# Altium project SolMPPT.PrjPcb
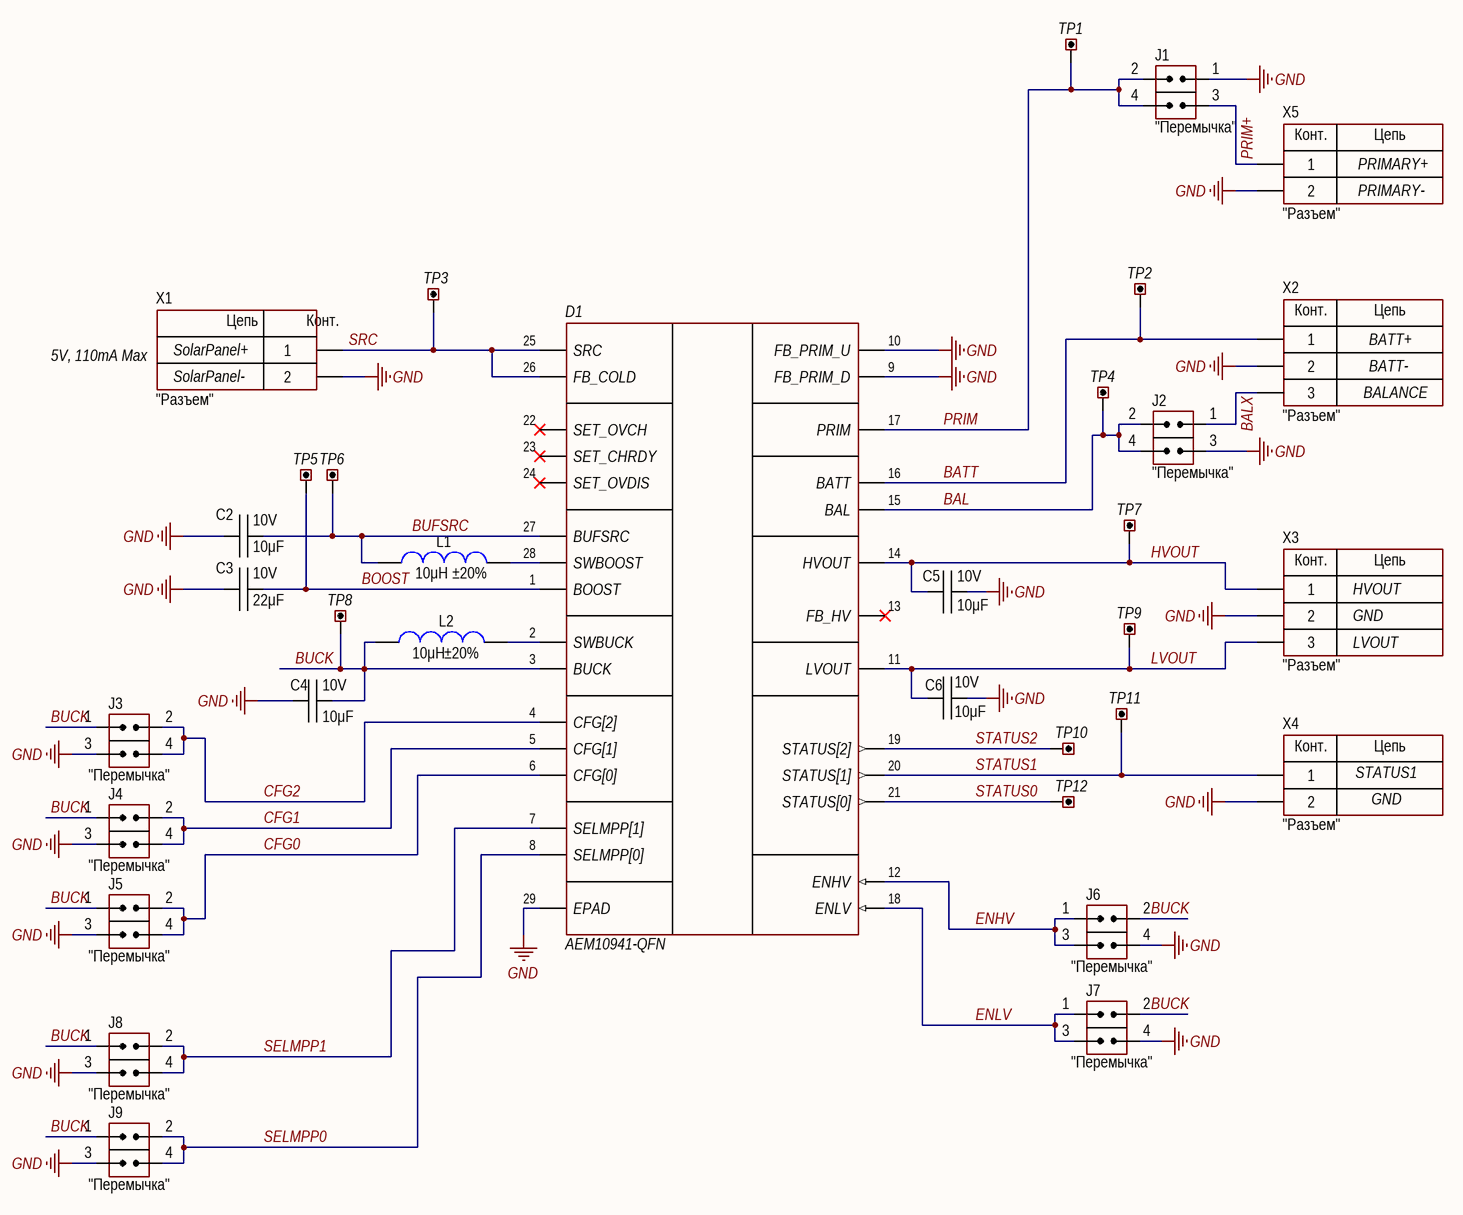
[diagram p0: page1.SchDoc]
1 sheet, 34 parts. Net scope: global (net labels, ports and power ports of the same name join across sheets).
Board file: PCB.PcbDoc

## Sheet page1.SchDoc
size 420 x 297 mm; Author: Шпаков Д.; Address1: Address1; Address2: Address2; Address3: Address3; Address4: Address4; DocumentNumber: SolMPPT.0.0.2; SheetNumber: 1; Scale: 1:1; DocumentType: Схема электрическая принципиальная; FirstReferrence: SolMPPT.0.0.2

### Parts
C2  value 10μF  Voltage: 10V  [CAP: 0603]
C3  value 22μF  Voltage: 10V  [CAP: 0603]
C4  value 10μF  Voltage: 10V  [CAP: 0603]
C5  value 10μF  Voltage: 10V  [CAP: 0603]
C6  value 10μF  Voltage: 10V  [CAP: 0603]
D1  AEM10941-QFN  [QFN50P500X500X85_HS-29N]
J1  CommentText: "Перемычка"  [CON: JUMPER x2]
J2  CommentText: "Перемычка"  [CON: JUMPER x2]
J3  CommentText: "Перемычка"  [CON: JUMPER x2]
J4  CommentText: "Перемычка"  [CON: JUMPER x2]
J5  CommentText: "Перемычка"  [CON: JUMPER x2]
J6  CommentText: "Перемычка"  [CON: JUMPER x2]
J7  CommentText: "Перемычка"  [CON: JUMPER x2]
J8  CommentText: "Перемычка"  [CON: JUMPER x2]
J9  CommentText: "Перемычка"  [CON: JUMPER x2]
L1  value 10μH  Tolerance: ±20%  [IND: SDR0302]
L2  value 10μH  Tolerance: ±20%  [IND: 0603]
TP1  TestPoint  [TestPad]  (value not drawn)
TP2  TestPoint  [TestPad]  (value not drawn)
TP3  TestPoint  [TestPad]  (value not drawn)
TP4  TestPoint  [TestPad]  (value not drawn)
TP5  TestPoint  [TestPad]  (value not drawn)
TP6  TestPoint  [TestPad]  (value not drawn)
TP7  TestPoint  [TestPad]  (value not drawn)
TP8  TestPoint  [TestPad]  (value not drawn)
TP9  TestPoint  [TestPad]  (value not drawn)
TP10  TestPoint  [TestPad]  (value not drawn)
TP11  TestPoint  [TestPad]  (value not drawn)
TP12  TestPoint  [TestPad]  (value not drawn)
X1  CommentText: "Разъем"  [CON: PLS-2]
X2  CommentText: "Разъем"  [CON: PLS-3]
X3  CommentText: "Разъем"  [CON: PLS-3]
X4  CommentText: "Разъем"  [CON: PLS-2]
X5  CommentText: "Разъем"  [CON: PLS-2]

### Nets
GND: C2.1 C3.2 C4.1 C5.1 C6.2 D1.9(FB_PRIM_D) D1.10(FB_PRIM_U) D1.29(EPAD) J1.1(IN) J2.3(IN) J3.3(IN) J4.3(IN) J5.3(IN) J6.4(IN) J7.4(IN) J8.3(IN) J9.3(IN) X1.2 X2.2 X3.2 X4.2 X5.2
BAL: D1.15(BAL) J2.2(IN) J2.4(IN) TP4.1
BALX: J2.1(IN) X2.3
BATT: D1.16(BATT) TP2.1 X2.1
BOOST: C3.1 D1.1(BOOST) TP5.1
BUCK: C4.2 D1.3(BUCK) J3.1(IN) J4.1(IN) J5.1(IN) J6.2(IN) J7.2(IN) J8.1(IN) J9.1(IN) L2.2 TP8.1
BUFSRC: C2.2 D1.27(BUFSRC) L1.2 TP6.1
CFG0: D1.6(CFG[0]) J5.2(IN) J5.4(IN)
CFG1: D1.5(CFG[1]) J4.2(IN) J4.4(IN)
CFG2: D1.4(CFG[2]) J3.2(IN) J3.4(IN)
ENHV: D1.12(ENHV) J6.1(IN) J6.3(IN)
ENLV: D1.18(ENLV) J7.1(IN) J7.3(IN)
HVOUT: C5.2 D1.14(HVOUT) TP7.1 X3.1
LVOUT: C6.1 D1.11(LVOUT) TP9.1 X3.3
PRIM: D1.17(PRIM) J1.2(IN) J1.4(IN) TP1.1
PRIM+: J1.3(IN) X5.1
SELMPP0: D1.8(SELMPP[0]) J9.2(IN) J9.4(IN)
SELMPP1: D1.7(SELMPP[1]) J8.2(IN) J8.4(IN)
SRC: D1.25(SRC) D1.26(FB_COLD) TP3.1 X1.1
STATUS0: D1.21(STATUS[0]) TP12.1
STATUS1: D1.20(STATUS[1]) TP11.1 X4.1
STATUS2: D1.19(STATUS[2]) TP10.1
NetD1_2: D1.2(SWBUCK) L2.1
NetD1_28: D1.28(SWBOOST) L1.1

Not connected (* = marked no-connect by the designer): D1 13(FB_HV)* 22(SET_OVCH)* 23(SET_CHRDY)* 24(SET_OVDIS)*

### Notes on the sheet
- PRIMARY+
- PRIMARY-
- 5V, 110mA Max
- (near X1) SolarPanel+
- (near X1) SolarPanel-
- BALANCE
- BATT+
- BATT-
- HVOUT
- GND
- LVOUT
- STATUS1
- Перв. примен.
- Справ. №
- Подп. и дата
- Инв. № дубл.
- Взам. инв. №
- Разраб.
- Изм.
- Лист
- № докум.
- Подп.
- Дата
- Лит.
- Масса
- Масштаб
- Пров.
- Т.контр.
- Листов
- Инв. № подл.
- Утв.
- Н.контр.
- 2.106-A3
- Копировал
- Формат А3
- (in symbol PLS-2) Цепь; Конт.
- (in symbol PLS-3) Конт.; Цепь

### Library data of the parts
C2 C4-C6 = Ceramic_0603: Manufacturer: Murata Electronics; PartNumber: GRM188R61A106ME69D; ValueManufacturerPartNumber: Ceramic capacitor, 10μF, X5R, ±20%, 10V, 0603, -55...+85°C; TypeCapacitor: Ceramic capacitor; Tolerance: ±20%; TypeDielectric: X5R; Package: 0603; HelpURL: https://www.digikey.com/en/products/detail/murata-electronics/GRM188R61A106ME69D/5027560; Temperature: -55...+85°C
C3 = Ceramic_0603: Manufacturer: Murata Electronics; PartNumber: GRM188R61A226ME15D; ValueManufacturerPartNumber: Ceramic capacitor, 22μF, X5R, ±20%, 10V, 0603, -55...+85°C; TypeCapacitor: Ceramic capacitor; Tolerance: ±20%; TypeDielectric: X5R; Package: 0603; HelpURL: https://www.digikey.com/en/products/detail/murata-electronics/GRM188R61A226ME15D/5027561; Temperature: -55...+85°C
D1 = AEM10941: Power Management Specialised - PMIC AEM10941 IC - Photovoltaic Energy Harvesting Manager.; Manufacture: e-peas; OperationTemperature: -40...+125°C; Case: QFN-28; PartNumber: AEM10941-QFN; HelpURL: https://eu.mouser.com/ProductDetail/e-peas/AEM10941-QFN/?qs=W%2FMpXkg%252BdQ7CeqB2lBPbRQ%3D%3D; Type: Photovoltaic Energy Harvesting Manager
J1-J9 = Jumper_double
L1 = Inductor_SDR0302: Manufacturer: Bourns; PartNumber: SDR0302-100ML; ValueManufacturerPartNumber: Fixed inductor, 10μH, ±20%, SDR0302, 900mA, -40...+125°C; TypeInductor: Fixed inductor; MaxCurrent: 900mA; Package: SDR0302; HelpURL: https://www.digikey.com/product-detail/en/bourns-inc/SDR0302-100ML/SDR0302-100MLCT-ND/2127048; Temperature: -40...+125°C
L2 = Inductor_0603: Manufacturer: TDK Corporation; PartNumber: MLZ1608M100WT000; ValueManufacturerPartNumber: Fixed inductor, 10μH, ±20%, 0603, 250mA, -55...+125°C; TypeInductor: Fixed inductor; MaxCurrent: 250mA; Package: 0603; HelpURL: https://www.digikey.com/en/products/detail/tdk-corporation/MLZ1608M100WT000/2465148; Temperature: -55...+125°C
TP1-TP12 = TestPoint: SMT test point
X1 X4 X5 = PLS-2: Manufacturer: Connfly; ValueManufacturerPartNumber: Connector, 2pin, 2.54mm, 500VAC, 3A; TypeConnector: Connector; VoltageMax: 500VAC; Pitch: 2.54mm; CurrentMax: 3A; Multichannel: 2pin; HelpURL: https://www.chipdip.ru/product/pls-2; PartNumber: PLS-2
X2 X3 = PLS-3: Manufacturer: Connfly; ValueManufacturerPartNumber: Connector, 3pin, 2.54mm, 500VAC, 3A; TypeConnector: Connector; VoltageMax: 500VAC; Pitch: 2.54mm; CurrentMax: 3A; Multichannel: 3pin; HelpURL: https://www.chipdip.ru/product/pls-3; PartNumber: PLS-3